# Altium schematic sheet INDEX.SchDoc: INDEX
size 420 x 297 mm; CheckedBy: BAO BUI Q.; Author: SANG HUYNH; DocumentNumber: 1; Revision: V1.0.0; SheetNumber: 2; SheetTotal: 11
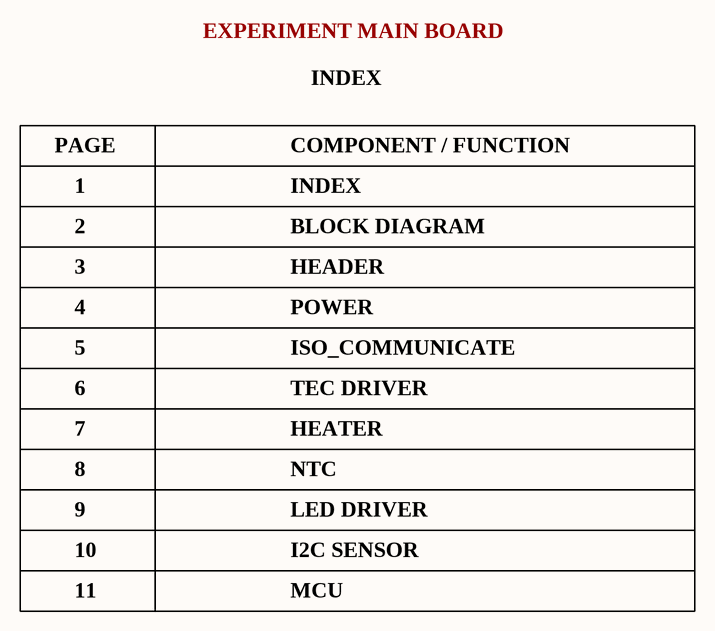
[diagram p0: INDEX.SchDoc]

## Notes on the sheet
- EXPERIMENT MAIN BOARD
- PAGE
- COMPONENT / FUNCTION
- INDEX
- 1
- 2
- 3
- BLOCK DIAGRAM
- HEADER
- 4
- POWER
- 5
- 6
- ISO_COMMUNICATE
- TEC DRIVER
- 7
- 8
- HEATER
- NTC
- 9
- 10
- LED DRIVER
- I2C SENSOR
- 11
- MCU
- Project:
- BEE-PC1
- Sub-system:
- NANORACK_EXP_CONTROLLER
- Design by:
- SANG HUYNH
- BAO BUI Q.
- Sheet title:
- Sheet
- A3
- of
- Checked by:
- Approved by:
- VU PHAM
- Revision:
- Document No:
- V1.0.0
- Size:
- Date:
- 01/10/2024